# EAGLE design LowduinoSMD (EAGLE 7.2.0)
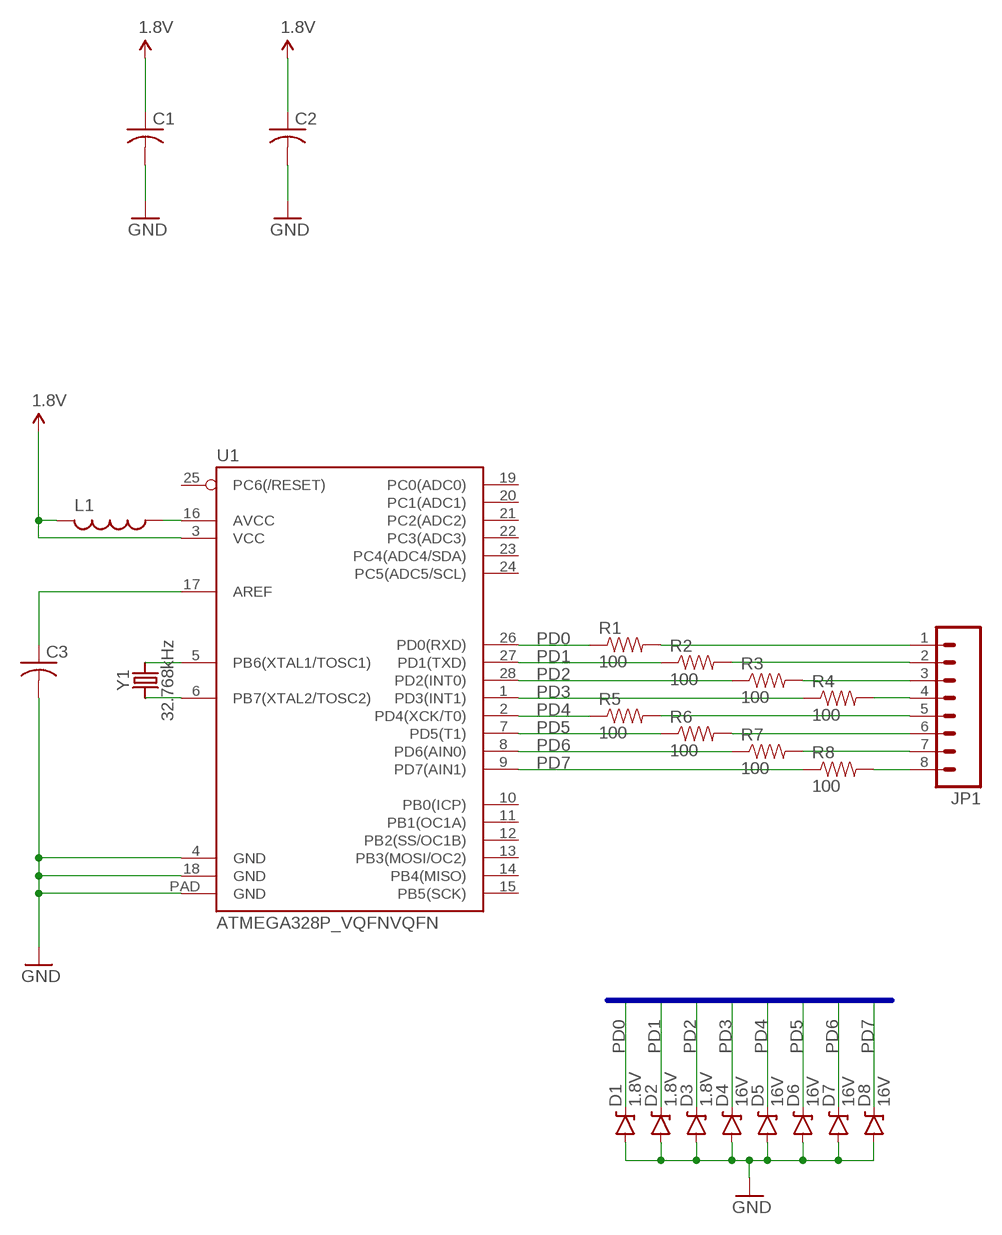
[diagram p0: schematic, sheet 1]

## Parts
C1  C-USC0201  [C0201]
C2  C-USC0402  [C0402]
C3  C-USC0201  [C0201]
D1  1.8V  DIODE-ZENER16V  [SOD-123]
D2  1.8V  DIODE-ZENER16V  [SOD-123]
D3  1.8V  DIODE-ZENER16V  [SOD-123]
D4  16V  DIODE-ZENER16V  [SOD-123]
D5  16V  DIODE-ZENER16V  [SOD-123]
D6  16V  DIODE-ZENER16V  [SOD-123]
D7  16V  DIODE-ZENER16V  [SOD-123]
D8  16V  DIODE-ZENER16V  [SOD-123]
JP1  M08SILK_FEMALE_PTH  [1X08]
L1  L-USL0201  [L0201]
R1  100  100OHM-1/10W-1%(0603)  [0603-RES]
R2  100  100OHM-1/10W-1%(0603)  [0603-RES]
R3  100  100OHM-1/10W-1%(0603)  [0603-RES]
R4  100  100OHM-1/10W-1%(0603)  [0603-RES]
R5  100  100OHM-1/10W-1%(0603)  [0603-RES]
R6  100  100OHM-1/10W-1%(0603)  [0603-RES]
R7  100  100OHM-1/10W-1%(0603)  [0603-RES]
R8  100  100OHM-1/10W-1%(0603)  [0603-RES]
U1  ATMEGA328P_VQFNVQFN  [VQFN-28]
Y1  32.768kHz  FX12232.768KHZ  [2-SMD]

## Nets
1.8V: C1.1 C2.1 L1.2 U1.3(VCC)
GND: C1.2 C2.2 C3.2 D1.A D2.A D3.A D4.A D5.A D6.A D7.A D8.A U1.4(GND) U1.18(GND) U1.PAD(GND)
N$1: C3.1 U1.17(AREF)
N$2: L1.1 U1.16(AVCC)
N$3: U1.5(PB6(XTAL1/TOSC1)) Y1.2
N$4: U1.6(PB7(XTAL2/TOSC2)) Y1.1
N$5: JP1.1 R1.2
N$6: JP1.2 R2.2
N$7: JP1.3 R3.2
N$8: JP1.4 R4.2
N$9: JP1.5 R5.2
N$10: JP1.6 R6.2
N$11: JP1.7 R7.2
N$12: JP1.8 R8.2
PD0: D1.C R1.1 U1.26(PD0(RXD))
PD1: D2.C R2.1 U1.27(PD1(TXD))
PD2: D3.C R3.1 U1.28(PD2(INT0))
PD3: D4.C R4.1 U1.1(PD3(INT1))
PD4: D5.C R5.1 U1.2(PD4(XCK/T0))
PD5: D6.C R6.1 U1.7(PD5(T1))
PD6: D7.C R7.1 U1.8(PD6(AIN0))
PD7: D8.C R8.1 U1.9(PD7(AIN1))
Unconnected: U1.10(PB0(ICP)) U1.11(PB1(OC1A)) U1.12(PB2(SS/OC1B)) U1.13(PB3(MOSI/OC2)) U1.14(PB4(MISO)) U1.15(PB5(SCK)) U1.19(PC0(ADC0)) U1.20(PC1(ADC1)) U1.21(PC2(ADC2)) U1.22(PC3(ADC3)) U1.23(PC4(ADC4/SDA)) U1.24(PC5(ADC5/SCL)) U1.25(PC6(/RESET))

## Buses
PD[0..7]

## Library data of the parts
C1-C3 = rcl:C-US: CAPACITOR, American symbol
D1-D3 = SparkFun-DiscreteSemi:DIODE-ZENER: Zener Diode Production Part - 8199 3.4V Zener Voltage; PROD_ID: DIO-12440; VALUE: 16V
D4-D8 = SparkFun-DiscreteSemi:DIODE-ZENER: Zener Diode Production Part - 8199 3.4V Zener Voltage; PROD_ID: DIO-12440
JP1 = SparkFun-Connectors:M08: Header 8 Standard 8-pin 0.1" header. Use with straight break away headers (SKU : PRT-00116), right angle break away headers (PRT-00553), swiss pins (PRT-00743), machine pins (PRT-00117), and female headers (PRT-00115).; PROD_ID: CONN-08438
L1 = rcl:L-US: INDUCTOR, American symbol
R1-R8 = SparkFun-Resistors:100OHM-1/10W-1%(0603): RES-07863; PROD_ID: RES-07863
U1 = SparkFun-DigitalIC:ATMEGA328P_VQFN
Y1 = fx122:FX122: FX122 - SMD 2.0 x 1.2 Tuning Fork Crystal Technical Specifications: Frequency: 32.768 kHz Frequency Tolerance @ 25ºC: ±20 PPM Frequency Stability Temperature Coefficient: -0.04 PPM / (ΔºC)^2 0.6mm Height Long Term Stability http://www.foxonline.com/pdfs/FX122.pdf; DIGIKEY: 631-1261-1-ND

## Board
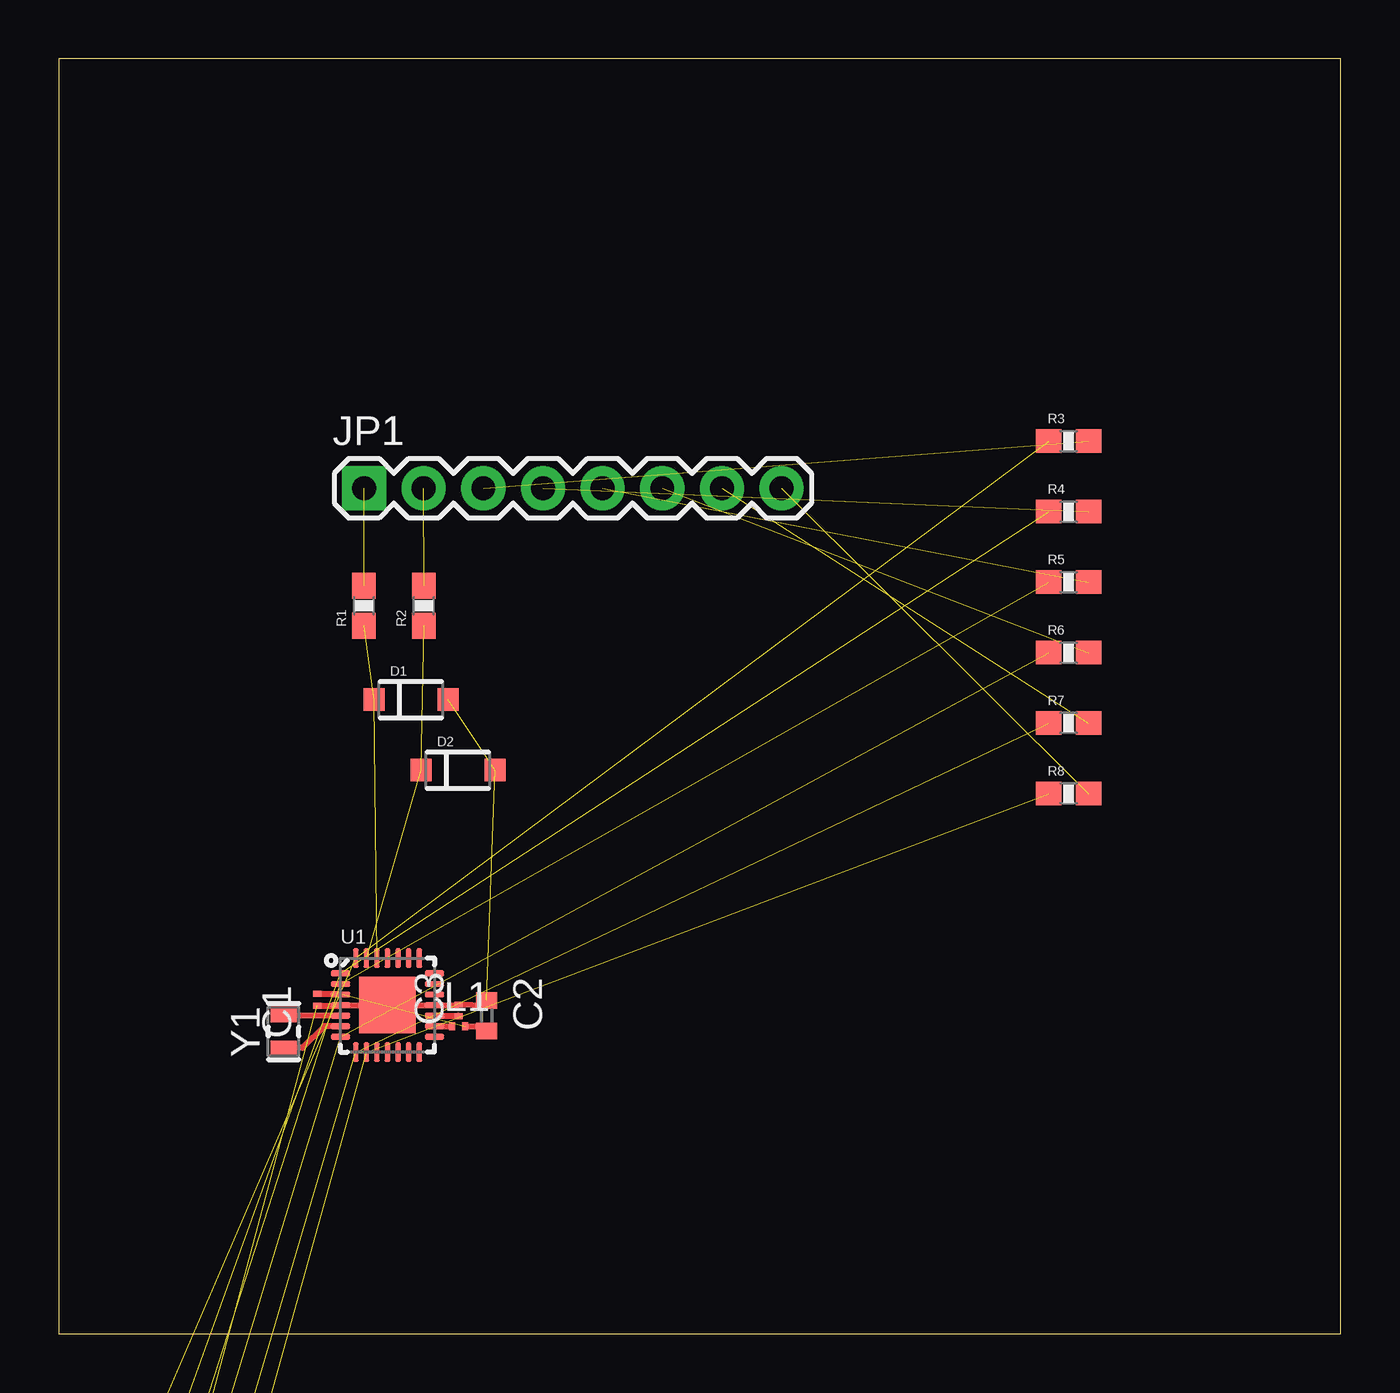
[diagram p1: board, top side]

Size 54.59 x 54.28 mm. Coordinates in mm from the lower left corner, seen from the top.
Outline: 0,0 54.59,0 54.59,54.28 0,54.28 0,0
Copper layers (1*16): Top 0.035mm / dielectric 1.5mm / Bottom 0.035mm
Design rules "default": minimum track width 10mil, minimum drill 24mil, track to track 8mil, track to pad 8mil, pad to pad 8mil, via to via 8mil, smd to smd 8mil, copper to edge 40mil, drill to drill 8mil, minimum pad ring 10mil, minimum via ring 8mil, stop-mask expansion 4mil, vias tented up to drill 0mil, thermal gap 10mil

### Footprints (pad centres in the part's own frame; a part is rotated, then mirrored left to right if it is on the bottom)
C0201 = smd 0.25 x 0.35: 1 -0.25,0; 2 0.25,0
C0402 = smd 0.7 x 0.9: 1 -0.65,0; 2 0.65,0
SOD-123 = smd 0.9 x 0.95: A 1.575,0; C -1.575,0
1X08 = drill 1.016 pad 1.88 square: 1 0,0 | drill 1.016 pad 1.88: 2 2.54,0; 3 5.08,0; 4 7.62,0; 5 10.16,0; 6 12.7,0; 7 15.24,0; 8 17.78,0
L0201 = smd 0.25 x 0.35: 1 -0.275,0; 2 0.275,0
0603-RES = smd 1.1 x 1: 1 -0.85,0; 2 0.85,0
VQFN-28 = smd 0.82 x 0.24: 1 -2,1.35; 2 -2,0.9; 3 -2,0.45; 4 -2,0; 5 -2,-0.45; 6 -2,-0.9; 7 -2,-1.35; 15 2,-1.35; 16 2,-0.9; 17 2,-0.45; 18 2,0; 19 2,0.45; 20 2,0.9; 21 2,1.35 | smd 0.24 x 0.82: 8 -1.35,-2; 9 -0.9,-2; 10 -0.45,-2; 11 0,-2; 12 0.45,-2; 13 0.9,-2; 14 1.35,-2; 22 1.35,2; 23 0.9,2; 24 0.45,2; 25 0,2; 26 -0.45,2; 27 -0.9,2; 28 -1.35,2 | smd 2.4 x 2.4: PAD 0,0
2-SMD = smd 0.6 x 1.1: 1 -0.7,0; 2 0.7,0

### Placement (x,y rotation side)
C1  11,14.22 270 top
C2  18.23,13.55 90 top
C3  17.02,13.78 90 top
D1  15,27 0 top
D2  17,24 0 top
D3  3,-10 0 top  (outside the outline)
D4  3,-14 0 top  (outside the outline)
D5  3,-18 0 top  (outside the outline)
D6  3,-22 0 top  (outside the outline)
D7  3,-26 0 top  (outside the outline)
D8  3,-30 0 top  (outside the outline)
JP1  13,36 0 top
L1  17.02,13.1 0 top
R1  13,31 90 top
R2  15.55,31 90 top
R3  43,38 0 top
R4  43,35 0 top
R5  43,32 0 top
R6  43,29 0 top
R7  43,26 0 top
R8  43,23 0 top
U1  14,14 0 top
Y1  9.57,12.88 90 top

### Tracks (layer width: path | path; a pad name or v marks a point on that pad's centre or on a via)
1.8V  (2 unrouted)
  Top 0.254: C1.1 12,14.47 | L1.2 18.02,13.1 C2.1
GND  (8 unrouted)
  Top 0.254: C1.2 12,13.97 U1.4 U1.PAD U1.18 17.02,14 C3.2 18.23,14 C2.2 18.02,14
N$1
  Top 0.254: U1.17 17.02,13.55 C3.1
N$2
  Top 0.254: U1.16 L1.1
N$3
  Top 0.254: U1.5 9.57,13.55 Y1.2
N$4
  Top 0.254: U1.6 11.3,13.1 10.38,12.18 Y1.1
N$5  (1 unrouted)
N$6  (1 unrouted)
N$7  (1 unrouted)
N$8  (1 unrouted)
N$9  (1 unrouted)
N$10  (1 unrouted)
N$11  (1 unrouted)
N$12  (1 unrouted)
PD0  (2 unrouted)
PD1  (2 unrouted)
PD2  (2 unrouted)
PD3  (2 unrouted)
PD4  (2 unrouted)
PD5  (2 unrouted)
PD6  (2 unrouted)
PD7  (2 unrouted)